# EasyEDA Pro project 2dof-experiment-system.eprj, board PCB2
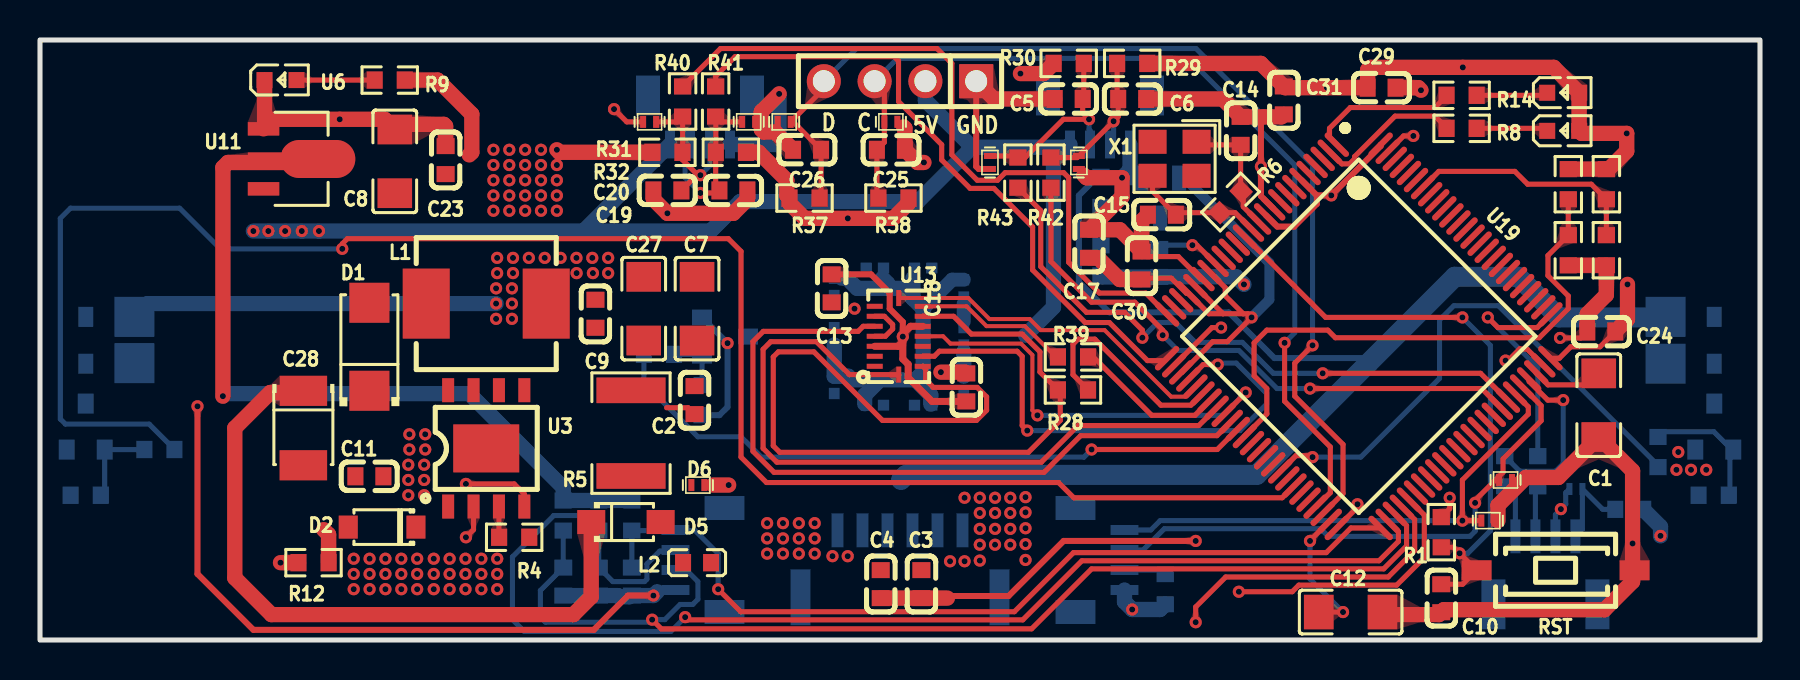
[diagram p5: board, top side]
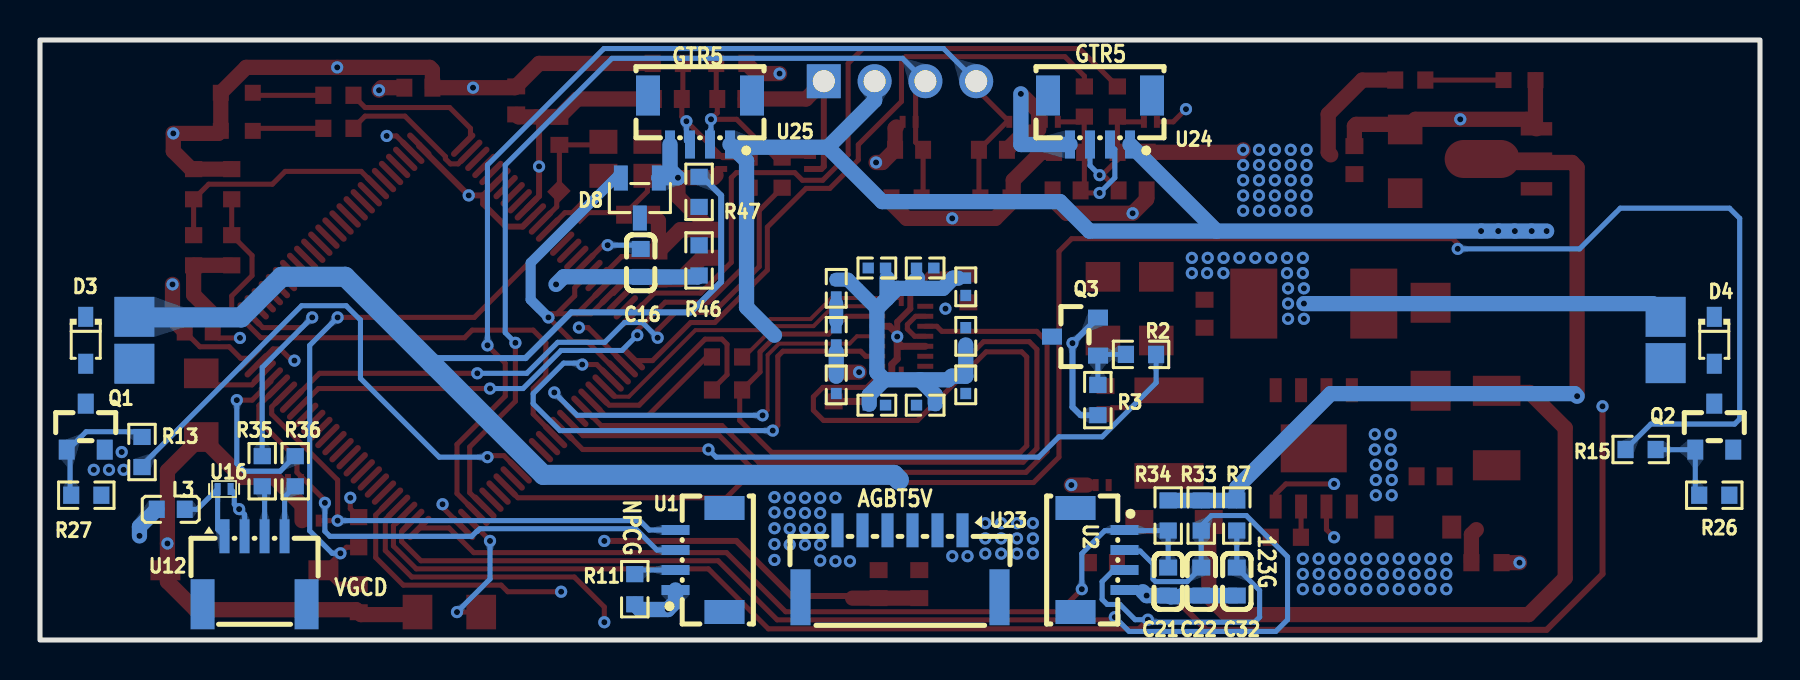
[diagram p6: board, bottom side, seen from below]

Outline 86 x 30 mm; copper layers: Top Layer, Inner1, Inner2, Bottom Layer. Coordinates in mm from the lower left corner of the outline.
Outline path: rectangle 0,30 86,0
Stack: Top Layer 0.035mm / Dielectric1 0.48mm PP er 4.5 / Inner1 0.035mm / Dielectric2 0.48mm FR4 er 4.5 / Inner2 0.035mm / Dielectric3 0.48mm PP er 4.5 / Bottom Layer 0.035mm

## Design rules (mm)
spacing safeClearance (default): track to track 0.152, other pairs 0.152 to 0.3
track width trackWidth (default): min 0.127, default 0.254, max 2.54
track width power: min 0.254, default 0.762, max 2.54
differential pair differentialPair (default): width min 0.127, default 0.254, max 2.54; gap min 0.152, default 0.152
via viaSize (default): diameter min 0.5, default 0.61, max 10; hole min 0.3, default 0.305, max 6
net GND uses power
net VBAT uses power
net +5V uses power
net +5VUSB uses power
net VCC uses power
net AGND uses power

## Placement (name value [footprint] x y rotation side)
C1  22uF  [C1206]  77.94 11.74 90 top
C2  10uF  [C0603]  32.73 11.99 90 top
C3  0.1uF  [C0603]  44.07 2.79 270 top
C4  1uF  [C0603]  42.04 2.79 270 top
C5  47pF  [C0603]  51.44 27.05 0 top
C6  47pF  [C0603]  54.61 27.05 180 top
C7  22uF  [C1206]  32.85 16.57 90 top
C8  22uF  [C1206]  17.74 23.93 90 top
C9  0.1uF  [C0603]  27.77 16.31 90 top
C10  1uF  [C0603]  70.06 2.09 270 top
C11  0.1uF  [C0603]  16.47 8.18 0 top
C12  22uF  [C1206]  65.53 1.4 180 top
C13  0.1uF  [C0603]  39.58 17.58 90 top
C14  20pF  [C0603]  60.03 25.46 270 top
C15  20pF  [C0603]  56.09 21.27 0 top
C16  0.1uF  [C0603]  55.97 18.85 270 bottom
C17  0.1uF  [C0603]  52.45 19.81 90 top
C18  0.1uF  [C0603]  46.31 12.63 270 top
C19  47pF  [C0603]  34.67 22.48 180 top
C20  47pF  [C0603]  31.37 22.48 0 top
C21  0.1uF  [C0603]  27.94 2.92 270 bottom
C22  0.1uF  [C0603]  29.59 2.92 270 bottom
C23  0.1uF  [C0603]  20.28 23.99 270 top
C24  0.1uF  [C0603]  78.06 15.42 180 top
C25  47pF  [C0603]  42.54 24.51 180 top
C26  47pF  [C0603]  38.35 24.51 0 top
C27  22uF  [C1206]  30.19 16.57 90 top
C28  47uF  [CASE-B_3528]  13.17 10.6 270 top
C29  0.1uF  [C0603]  67.08 27.62 0 top
C30  0.1uF  [C0603]  55.08 18.73 90 top
C31  0.1uF  [C0603]  62.19 26.98 270 top
C32  0.1uF  [C0603]  26.16 2.92 270 bottom
D1  SS32  [SMA_L4.3-W2.6-LS5.2-RD]  16.47 14.66 90 top
D2  SMFJ6.0A  [SOD-123_L2.8-W1.8-LS3.7-RD]  17.11 5.64 180 top
D3  1N5819WS  [SOD-323_L1.8-W1.3-LS2.5-RD]  83.71 14.99 270 bottom
D4  1N5819WS  [SOD-323_L1.8-W1.3-LS2.5-RD]  2.29 14.99 270 bottom
D5  DSS34  [SOD-123FL_L2.7-W1.8-LS3.8-RD]  29.3 5.9 0 top
D6  PESD12VV1BL,315  [SOD-882_L1.0-W0.6-BI]  32.89 7.75 180 top
D8  BAV99  [SOT-23-3_L2.9-W1.3-P1.90-LS2.4-BR]  56.01 22.1 90 bottom
H1  PZ254V-11-04P  [HDR-TH_4P-P2.54-V-M]  43 27.94 180 top
L1  10uH  [IND-SMD_L7.3-W6.8]  22.31 16.82 0 top
L2  BLM18PG221SN1D  [L0603]  32.85 3.87 180 top
L3  BLM18PG221SN1D  [L0603]  79.46 6.53 180 bottom
NC  NC  [R0603]  78.32 22.79 90 top
NC#2  NC  [R0603]  76.41 22.79 90 top
NOREF  -  [Pad_e1115]  81.28 16.16 90 top
NOREF#2  -  [Pad_e1121]  4.72 13.84 90 top
NOREF#3  -  [Pad_e1119]  81.28 13.81 90 top
NOREF#4  -  [Pad_e1123]  4.72 16.16 90 top
Q1  AO3400  [SOT-23_L2.9-W1.3-P1.90-LS2.4-BR]  83.71 10.67 270 bottom
Q2  AO3400  [SOT-23_L2.9-W1.3-P1.90-LS2.4-BR]  2.29 10.67 270 bottom
Q3  AO3400  [SOT-23_L2.9-W1.3-P1.90-LS2.4-BR]  34.25 15.17 180 bottom
R1  10kΩ  [R0603]  70.06 5.39 90 top
R2  120Ω  [R0603]  30.95 14.28 180 bottom
R3  10kΩ  [R0603]  33.11 11.99 270 bottom
R4  1.1kΩ  [R0603]  23.71 5.14 180 top
R5  0.3Ω  [R1812]  29.55 10.34 90 top
R6  1MΩ  [R0603]  59.52 21.9 45 top
R7  10kΩ  [R0603]  26.16 6.22 90 bottom
R8  1.5kΩ  [R0603]  71.08 25.58 180 top
R9  1.5kΩ  [R0603]  17.49 28 180 top
R11  5.1kΩ  [R0603]  56.26 2.54 270 bottom
R12  0Ω  [R0603]  13.68 3.87 0 top
R13  120Ω  [R0603]  80.9 9.4 270 bottom
R14  1.5kΩ  [R0603]  71.08 27.23 180 top
R15  120Ω  [R0603]  5.97 9.53 0 bottom
R16  430Ω  [R0402]  39.71 15.18 270 bottom
R17  430Ω  [R0402]  46.19 15.18 270 bottom
R18  430Ω  [R0402]  39.71 17.66 90 bottom
R19  430Ω  [R0402]  41.74 18.6 0 bottom
R20  430Ω  [R0402]  41.74 11.74 180 bottom
R21  430Ω  [R0402]  44.16 18.6 180 bottom
R22  430Ω  [R0402]  46.19 17.58 90 bottom
R23  430Ω  [R0402]  39.71 12.76 90 bottom
R24  430Ω  [R0402]  46.19 12.76 90 bottom
R25  430Ω  [R0402]  44.16 11.74 0 bottom
R26  10kΩ  [R0603]  2.29 7.24 180 bottom
R27  10kΩ  [R0603]  83.68 7.24 180 bottom
R28  33Ω  [R0603]  51.65 12.5 0 top
R29  1.5kΩ  [R0603]  54.61 28.83 0 top
R30  1.5kΩ  [R0603]  51.44 28.83 180 top
R31  1.5kΩ  [R0603]  31.37 24.38 180 top
R32  1.5kΩ  [R0603]  34.54 24.38 0 top
R33  10kΩ  [R0603]  27.94 6.22 90 bottom
R34  10kΩ  [R0603]  29.59 6.22 90 bottom
R35  100Ω  [R0603]  74.89 8.44 90 bottom
R36  100Ω  [R0603]  73.24 8.44 90 bottom
R37  4.7kΩ  [R0603]  38.23 22.1 180 top
R38  4.7kΩ  [R0603]  42.67 22.1 0 top
R39  33Ω  [R0603]  51.65 14.15 0 top
R40  33Ω  [R0603]  32.13 26.92 270 top
R41  33Ω  [R0603]  33.78 26.92 270 top
R42  33Ω  [R0603]  50.55 23.37 90 top
R43  33Ω  [R0603]  48.9 23.37 90 top
R44  100KΩ  [R0603]  78.32 19.49 270 top
R45  100KΩ  [R0603]  76.41 19.49 270 top
R46  10KΩ  [R0603]  53.05 18.98 90 bottom
R47  5.1KΩ  [R0603]  53.05 22.41 90 bottom
RST  K2-1107ST-E1SW-06  [SW-SMD_L6.0-W3.6-LS8.0]  75.78 3.49 0 top
U1  ZX-SH1.0-4PLT  [CONN-SMD_4P-P1.00_ZX-SH1.0-4PLN]  53 4 90 bottom
U2  ZX-SH1.0-4PLT  [CONN-SMD_4P-P1.00_ZX-SH1.0-4PLN]  33 4 270 bottom
U3  TP5400  [ESOP-8_L4.9-W3.9-P1.27-LS6.0-BL-EP]  22.31 9.58 0 top
U5  YLED0603B  [LED0603-RD]  76.16 25.46 0 top
U6  YLED0603B  [LED0603-RD]  12.03 28 0 top
U8  YLED0603B  [LED0603-RD]  76.16 27.36 0 top
U9  PESD5V0F1BL  [SOD-882_L1.0-W0.6-BI]  47.5 23.88 270 top
U10  PESD5V0F1BL  [SOD-882_L1.0-W0.6-BI]  51.94 23.88 270 top
U11  AMS1117-3.3  [SOT-89_L4.5-W2.5-P1.50-LS4.2-BR]  12.53 24.06 180 top
U12  ZX-SH1.0-4PWT  [CONN-SMD_4P-P1.00_MEGASTAR_ZX-SH1.0-4PWT]  75.27 3.49 180 bottom
U13  BMI088  [LGA-16_L4.5-W3.0-P0.50-BL]  42.94 15.18 0 top
U14  PESD5V0F1BL  [SOD-882_L1.0-W0.6-BI]  35.43 25.91 0 top
U15  PESD5V0F1BL  [SOD-882_L1.0-W0.6-BI]  30.48 25.91 180 top
U16  PESD5V0F1BL  [SOD-882_L1.0-W0.6-BI]  76.79 7.55 180 bottom
U17  PESD5V0F1BL  [SOD-882_L1.0-W0.6-BI]  42.54 25.91 0 top
U18  PESD5V0F1BL  [SOD-882_L1.0-W0.6-BI]  37.21 25.91 180 top
U19  STM32F407VET6  [LQFP-100_L14.0-W14.0-P0.50-LS16.0-BL]  65.94 15.18 225 top
U20  PESD5V0F1BL  [SOD-882_L1.0-W0.6-BI]  73.28 8 180 top
U21  PESD5V0F1BL  [SOD-882_L1.0-W0.6-BI]  72.39 5.97 180 top
U23  BX-BX-GH1.25-6PLT  [CONN-SMD_6P-P1.25_BX-BX-GH1.25-6PLT]  43 3.81 0 bottom
U24  ZX-SH1.0-4PLT  [CONN-SMD_4P-P1.00_ZX-SH1.0-4PLN]  33 26 0 bottom
U25  ZX-SH1.0-4PLT  [CONN-SMD_4P-P1.00_ZX-SH1.0-4PLN]  53 26 0 bottom
X1  8MHz  [CRYSTAL-SMD_4P-L3.2-W2.5-BL]  56.73 24.06 180 top

## Footprints (pads in the part's own frame, mm; a bottom-side part is the same pattern mirrored in y, then rotated)
C0603
  rect 0.8x0.9 smd: 1(-0.7,0) 2(0.7,0)
C1206
  rect 1.485x1.728 smd: 1(-1.593,0) 2(1.593,0)
CASE-B_3528
  rect 1.506x2.376 smd: 1(-1.861,0) 2(1.861,0)
CONN-SMD_4P-P1.00_MEGASTAR_ZX-SH1.0-4PWT
  rect 0.5x1.7 smd: 1(-1.5,1.7) 2(-0.5,1.7) 3(0.5,1.7) 4(1.5,1.7)
  rect 1.2x2.5 smd: 5(2.6,-1.7) 6(-2.6,-1.7)
CONN-SMD_4P-P1.00_ZX-SH1.0-4PLN
  rect 0.5x1.4 smd: 1(-1.5,1.225) 2(-0.5,1.225) 3(0.5,1.225) 4(1.5,1.225)
  rect 1.2x2 smd: 5(2.6,-1.225) 6(-2.6,-1.225)
CONN-SMD_6P-P1.25_BX-BX-GH1.25-6PLT
  rect 0.6x1.7 smd: 1(-3.125,-1.675) 2(-1.875,-1.675) 3(-0.625,-1.675) 4(0.625,-1.675) 5(1.875,-1.675) 6(3.125,-1.675)
  rect 1x2.8 smd: 7(4.975,1.675) 8(-4.975,1.675)
CRYSTAL-SMD_4P-L3.2-W2.5-BL
  rect 1.4x1.2 smd: 1(-1.1,-0.85) 2(1.1,-0.85) 3(1.1,0.85) 4(-1.1,0.85)
ESOP-8_L4.9-W3.9-P1.27-LS6.0-BL-EP
  rect 0.6x1.2 smd: 1(-1.905,-2.909) 2(-0.635,-2.909) 3(0.635,-2.909) 4(1.905,-2.909) 5(1.905,2.909) 6(0.635,2.909) 7(-0.635,2.909) 8(-1.905,2.909)
  rect 3.3x2.4 smd: 9(0,0)
HDR-TH_4P-P2.54-V-M
  rect 1.7x1.7 hole 1.1: 1(-3.81,0)
  round 1.7 hole 1.1: 2(-1.27,0) 3(1.27,0) 4(3.81,0)
IND-SMD_L7.3-W6.8
  rect 2.35x3.5 smd: 1(-3,0) 2(3,0)
L0603
  rect 0.8x0.864 smd: 1(-0.7,0) 2(0.7,0)
LED0603-RD
  rect 0.8x0.8 smd: 1(-0.799,0) 2(0.799,0)
LGA-16_L4.5-W3.0-P0.50-BL
  rect 0.8x0.25 smd: 1(-1.2,-1.498) 2(-1.2,-0.998) 3(-1.2,-0.498) 4(-1.2,0.002) 5(-1.2,0.502) 6(-1.2,1.002) 7(-1.2,1.502) 9(1.2,1.502) 10(1.2,1.002) 11(1.2,0.502) 12(1.2,0.002) 13(1.2,-0.498) 14(1.2,-0.998) 15(1.2,-1.498)
  rect 0.25x0.8 smd: 8(0,1.915) 16(0,-1.915)
LQFP-100_L14.0-W14.0-P0.50-LS16.0-BL
  oval 0.3x1.6 smd: 1(-6,-7.55) 2(-5.5,-7.55) 3(-5,-7.55) 4(-4.5,-7.55) 5(-4,-7.55) 6(-3.5,-7.55) 7(-3,-7.55) 8(-2.5,-7.55) 9(-2,-7.55) 10(-1.5,-7.55) 11(-1,-7.55) 12(-0.5,-7.55) 13(0,-7.55) 14(0.5,-7.55) 15(1,-7.55) 16(1.5,-7.55) 17(2,-7.55) 18(2.5,-7.55) 19(3,-7.55) 20(3.5,-7.55) 21(4,-7.55) 22(4.5,-7.55) 23(5,-7.55) 24(5.5,-7.55) 25(6,-7.55) 51(6,7.55) 52(5.5,7.55) 53(5,7.55) 54(4.5,7.55) 55(4,7.55) 56(3.5,7.55) 57(3,7.55) 58(2.5,7.55) 59(2,7.55) 60(1.5,7.55) 61(1,7.55) 62(0.5,7.55) 63(0,7.55) 64(-0.5,7.55) 65(-1,7.55) 66(-1.5,7.55) 67(-2,7.55) 68(-2.5,7.55) 69(-3,7.55) 70(-3.5,7.55) 71(-4,7.55) 72(-4.5,7.55) 73(-5,7.55) 74(-5.5,7.55) 75(-6,7.55)
  oval 1.6x0.3 smd: 26(7.55,-6) 27(7.55,-5.5) 28(7.55,-5) 29(7.55,-4.5) 30(7.55,-4) 31(7.55,-3.5) 32(7.55,-3) 33(7.55,-2.5) 34(7.55,-2) 35(7.55,-1.5) 36(7.55,-1) 37(7.55,-0.5) 38(7.55,0) 39(7.55,0.5) 40(7.55,1) 41(7.55,1.5) 42(7.55,2) 43(7.55,2.5) 44(7.55,3) 45(7.55,3.5) 46(7.55,4) 47(7.55,4.5) 48(7.55,5) 49(7.55,5.5) 50(7.55,6) 76(-7.55,6) 77(-7.55,5.5) 78(-7.55,5) 79(-7.55,4.5) 80(-7.55,4) 81(-7.55,3.5) 82(-7.55,3) 83(-7.55,2.5) 84(-7.55,2) 85(-7.55,1.5) 86(-7.55,1) 87(-7.55,0.5) 88(-7.55,0) 89(-7.55,-0.5) 90(-7.55,-1) 91(-7.55,-1.5) 92(-7.55,-2) 93(-7.55,-2.5) 94(-7.55,-3) 95(-7.55,-3.5) 96(-7.55,-4) 97(-7.55,-4.5) 98(-7.55,-5) 99(-7.55,-5.5) 100(-7.55,-6)
Pad_e1115
  rect 2x2 smd far side: 1(0,0)
Pad_e1119
  rect 2x2 smd far side: 1(0,0)
Pad_e1121
  rect 2x2 smd far side: 1(0,0)
Pad_e1123
  rect 2x2 smd far side: 1(0,0)
R0402
  rect 0.566x0.54 smd: 1(-0.433,0) 2(0.433,0)
R0603
  rect 0.806x0.864 smd: 1(-0.753,0) 2(0.753,0)
R1812
  rect 1.282x3.456 smd: 1(-2.141,0) 2(2.141,0)
SMA_L4.3-W2.6-LS5.2-RD
  rect 2x2 smd: 1(-2.2,0) 2(2.2,0)
SOD-123_L2.8-W1.8-LS3.7-RD
  rect 0.95x1.15 smd: 1(-1.692,0) 2(1.692,0)
SOD-123FL_L2.7-W1.8-LS3.8-RD
  rect 1.4x1.2 smd: 1(-1.735,0) 2(1.735,0)
SOD-323_L1.8-W1.3-LS2.5-RD
  rect 1x0.75 smd: 1(-1.173,0) 2(1.173,0)
SOD-882_L1.0-W0.6-BI
  rect 0.3x0.6 smd: 1(-0.325,0) 2(0.325,0)
SOT-23-3_L2.9-W1.3-P1.90-LS2.4-BR
  rect 1.25x0.7 smd: 1(1,-0.95) 2(1,0.95) 3(-1,0)
SOT-23_L2.9-W1.3-P1.90-LS2.4-BR
  rect 1x0.8 smd: 1(1.15,-0.95) 2(1.15,0.95) 3(-1.15,0)
SOT-89_L4.5-W2.5-P1.50-LS4.2-BR
  rect 1.575x0.672 smd: 1(1.356,-1.5) 3(1.356,1.5)
  custom 5.377x1.9 smd: 2(-1.356,0.009)
SW-SMD_L6.0-W3.6-LS8.0
  rect 1.5x1 smd: 1(-3.95,0) 2(3.95,0)

## Nets
As in the schematic, except:
GND: C1.1 C3.2 C4.2 C5.1 C6.1 C8.2 C10.2 C12.1 C13.1 C14.1 C15.1 C16.2 C17.2 C18.1 C19.1 C20.1 C21.2 C22.2 C23.1 C24.2 C25.1 C26.1 C29.2 C30.2 C31.2 C32.2 D6.1 D8.1 H1.1 R11.2 R12.1 R44.2 R45.2 R46.1 RST.2 U1.1 U2.4 U6.1 U9.2 U10.2 U11.1 U12.2 U13.4 U13.6 U13.7 U14.2 U15.2 U16.2 U17.2 U18.2 U19.10 U19.20 U19.27 U19.74 U19.99 U20.1 U21.1 U24.4 U25.4
VBAT: C7.2 C9.2 C27.2 D3.1 D4.1 L1.2 NOREF.1 NOREF#4.1 R47.2 U3.6 U23.3 U23.4
$1N68715: D4.2 NOREF#2.1 Q2.3
$1N70428: D3.2 NOREF#3.1 Q1.3
$1N138361: C10.1 R1.1 RST.1 U19.14
$1N140381: NC.1 R44.1 U19.94
$1N140807: NC#2.1 R45.1 U19.37

Pads without a net: U1 5 6; U2 5 6; U12 5 6; U13 1 2 13; U19 3 4 5 7 8 9 15 16 17 23 24 38 39 40 41 43 45 46 56 57 58 59 60 61 62 63 64 65 66 67 77 78 79 80 81 82 83 84 85 86 87 88 89 90 91 92 93 95 96 97 98; U23 7 8; U24 5 6; U25 5 6; X1 2 4

## Via types
v1: diameter 0.61, hole 0.305, Top Layer to Bottom Layer, 198 vias

## Routing (per net, layer and track width the routed paths; a pad name or vN(x,y) marks a point on that pad's centre or on a via; arc(x,y) is an arc through that point)
+5V: length 120.3
  Top Layer w0.762: D5.1 27.56,2.16 26.67,1.27 11.57,1.27 9.74,3.1 9.74,10.6 11.52,12.38 13.09,12.38 C28.1
  Bottom Layer w0.7: 44.16,16.57 45.6,18.02 R22.2
  Bottom Layer w0.762: 40.09,18.09 40.35,18.09 40.85,17.58 42.38,17.58 ; 43.65,17.07 43.65,18.09 ; 43.65,17.07 43.14,17.58 42.38,17.58 ; 43.65,17.07 44.16,16.57 44.16,13.39 43.78,13.01 ; U24.1 27.17,20.45 ; 27.17,20.45 33.53,20.45 35,21.92 43.89,21.92 46.61,24.64 ; 27.17,20.45 v1(13.95,20.45) v1(13.09,20.45) v1(12.26,20.45) v1(11.42,20.45) v1(10.67,20.45) ; 46.61,24.64 44.27,26.98 H1.2 ; 46.61,24.64 51.36,24.64 ; 46.19,13.19 46.19,14.41 ; 44.54,11.79 44.54,12.25 43.78,13.01 ; 49.28,15.24 50.67,16.64 50.67,23.95 51.36,24.64 ; 42.38,17.58 42.38,17.84 42.12,18.09 ; 51.36,24.64 U25.1 ; 42,13.01 41.24,12.25 41.24,11.82 ; 42,13.01 43.78,13.01 ; 42,13.01 40.59,13.01 40.41,13.19 39.71,13.19 R16.2
  vias: v1(18.41,8.76) v1(18.41,8) v1(18.41,7.24) v1(18.47,10.29) v1(18.47,9.53) v1(19.21,8.76) v1(19.21,8) v1(19.21,7.24) v1(19.26,10.29) v1(19.26,9.53)
+5VUSBIN:
  vias: v1(36.36,5.84) v1(36.36,5.08) v1(36.36,4.32) v1(37.15,5.84) v1(37.15,5.08) v1(37.15,4.32) v1(37.94,5.84) v1(37.94,5.08) v1(37.94,4.32) v1(38.74,5.84) v1(38.74,5.08) v1(38.74,4.32) v1(39.62,4.19) v1(40.39,4.19)
AGND: length 8.2
  Top Layer w0.762: 14.18,5.52 14.43,5.27 14.43,3.87
  Bottom Layer w0.3: R3.2 33.97,11.24 34.38,11.65 v1(34.38,14.84) Q3.2
  vias: v1(15.69,4.06) v1(15.69,3.3) v1(15.69,2.54) v1(16.48,4.06) v1(16.48,3.3) v1(16.48,2.54) v1(17.27,4.06) v1(17.27,3.3) v1(17.27,2.54) v1(18.06,4.06) v1(18.06,3.3) v1(18.06,2.54) v1(18.86,4.06) v1(18.86,3.3) v1(18.86,2.54) v1(19.69,4.06) v1(19.69,3.3) v1(19.69,2.54) v1(20.48,4.06) v1(20.48,3.3) v1(20.48,2.54) v1(21.27,4.06) v1(21.27,3.3) v1(21.27,2.54) v1(22.07,4.06) v1(22.07,3.3) v1(22.07,2.54) v1(22.86,4.06) v1(22.86,3.3) v1(22.86,2.54) v1(45.5,3.94) v1(46.23,7.11) v1(46.23,3.94) v1(46.99,7.11) v1(46.99,6.35) v1(46.99,5.56) v1(46.99,4.76) v1(46.99,3.97) v1(47.75,7.11) v1(47.75,6.35) v1(47.75,5.56) v1(47.75,4.76) v1(48.51,7.11) v1(48.51,6.35) v1(48.51,5.56) v1(48.51,4.76) v1(49.28,7.14) v1(49.28,6.38) v1(49.28,5.59) v1(49.28,4.8) v1(49.28,4) v1(81.82,8.51) v1(81.91,9.4) v1(82.55,8.51) v1(83.31,8.51)
GND: length 187.4
  Top Layer w0.254: v1(73.28,13.97) 73.41,13.97 73.99,14.55 74.35,14.55 U19.74 ; U19.20 58.04,18.05 56.92,19.17 55.33,19.17 C30.2 ; v1(28.7,26.54) 29.34,25.91 U15.2 ; 41.74,15.19 42.27,15.19 42.63,15.55 42.63,15.77 42.22,16.19 41.74,16.19 ; v1(76,15.1) 77.04,15.1 C24.2 ; v1(68.67,25.2) 68.18,25.2 U19.99 ; 56.71,13.73 58.6,15.62 v1(59.06,15.62)
  Top Layer w0.3: v1(30.67,2.22) 29.4,2.22 27.69,0.51 10.67,0.51 7.87,3.3 v1(7.87,11.68) ; H1.1 46.81,23.67 46.93,23.55 U9.2 ; v1(57.78,4.95) 51.18,4.95 48.43,2.2 45.61,2.2 ; 61.66,21.58 61.05,22.19 v1(61.05,23.68) 61.05,26.02 61.18,26.16
  Top Layer w0.762: 43.18,25.65 43.25,25.59 C25.1 43.88,23.88 v1(44.2,23.88) ; C20.1 30.67,22.04 v1(31.37,21.34) 34.67,21.34 35.37,22.04 35.37,22.48 ; v1(34.43,7.75) 33.66,7.75 ; C24.2 77.37,16.31 78.32,17.26 R44.2 R45.2 ; v1(36.96,27.31) 36.07,26.42 36.07,25.53 36.19,25.4 36.76,25.4 C26.1 ; C12.1 67.25,1.27 69.95,1.27 70.19,1.52 78.22,1.52 79.63,2.92 v1(79.63,4.83) 79.63,8.46 C1.1 75.92,8.13 74.29,8.13 72.9,6.73 72.9,5.97 ; v1(12.03,3.87) R12.1 ; C31.2 62.07,26.16 C14.1 59.14,27.05 C6.1 ; C15.1 55.08,20.95 C30.2 53.99,20.51 C17.2 54.1,22.16 v1(54.1,23.11) 52.32,23.11 52.2,23.24 ; 11.23,25.61 U6.1 ; 11.23,25.61 11.65,26.03 v1(14.99,26.03) 17.23,26.03 C8.2 18,25.78 20.19,25.78 20.28,25.69 C23.1 ; 11.23,25.61 U11.1 ; C4.2 C3.2 45.37,2.09 ; C5.1 47.7,27.05 H1.1 ; C29.2 68.92,27.62 v1(69.05,27.49) ; C18.1 46.25,13.39 v1(45.04,13.39)
  Bottom Layer w0.254: 75.77,5.19 75.77,6.27 v1(76.04,6.54) 76.29,6.79 76.29,7.37 U16.2
  Bottom Layer w0.762: U24.4 36.96,24.78 v1(36.96,27.31) ; R46.1 53.12,18.15 C16.2 55.98,18.16 59.82,18.16 v1(60.2,17.78) ; C32.2 C21.2 28.89,2.22 28.95,2.16 29.47,2.16 29.53,2.22 C22.2 v1(30.67,2.22) 30.86,2.41 ; U1.1 54.22,1.91 v1(54.61,1.52) 56,1.52 R11.2 ; 55.06,23.1 55.04,23.11 v1(54.1,23.11) 54.5,23.51 U25.4
  vias: v1(40.73,16.57)
VBAT: length 83.6
  Bottom Layer w0.3: 66.42,13.84 66.17,14.1 61.72,14.1 59.44,16.38 53.47,16.38 51.94,17.91 51.94,22.22 52.88,23.16 R47.2
  Bottom Layer w0.762: NOREF#4.1 5.38,16.82 v1(22.8,16.82)
  Bottom Layer w1: NOREF.1 81.25,16.13 75.95,16.13 73.91,18.16 70.74,18.16 60.83,8.25 43.31,8.25 43.05,8
  vias: v1(22.8,17.58) v1(22.8,16.06) v1(22.86,19.11) v1(22.86,18.34) v1(23.6,17.58) v1(23.6,16.82) v1(23.6,16.06) v1(23.65,19.11) v1(23.65,18.34) v1(24.44,19.11) v1(25.24,19.11) v1(26.03,19.11) v1(26.82,19.11) v1(26.83,18.34) v1(27.62,19.11) v1(27.65,18.34) v1(28.41,19.11) v1(28.41,18.34)
VCC: length 157.2
  Top Layer w0.254: 60.16,16.31 59.26,17.21 59.26,17.61 58.48,18.4 ; 60.16,16.31 59.15,16.31 ; 60.16,16.31 60.4,16.31 v1(60.58,16.13) 59.37,14.92 58.63,14.92 57.1,13.38 U19.28 ; 59.15,16.31 58.44,16.31 U19.22 57.32,17.34 56.57,18.09 55.14,18.09 C30.1 ; 59.15,16.31 U19.21 ; v1(70.49,7.11) 70.49,6.56 R1.2 ; U19.50 65.87,6.63 v1(65.87,6.79) ; U19.75 75.97,14.09 76.54,14.66 78,14.66 C24.1
  Top Layer w0.3: 63.84,22.23 63.84,21.81 62.71,20.67 61.86,20.67 61.31,21.23 ; 63.84,22.23 v1(64.56,22.23) 67.03,24.7 67.03,24.76 ; 63.84,22.23 63.07,23 ; C13.2 41.55,18.28 42.48,17.35 42.48,16.56 43.14,15.91 43.14,15.3
  Top Layer w0.35: C18.2 44.6,11.93 43.41,13.12 43.41,13.78 43.14,14.05 43.14,14.92 ; 41.74,14.69 42.91,14.69 43.14,14.92 ; 43.14,14.92 v1(43.14,15.17) 43.08,15.23 43.53,15.69 U13.11
  Top Layer w0.762: R30.2 50.17,28.32 v1(49.02,28.32) ; 66.32,27.62 v1(64.35,27.62) 62.25,27.62 61.04,28.83 R29.2 ; C29.1 66.38,28.5 66.51,28.63 v1(71.14,28.63) 75.69,28.63 U8.2 U5.2 77.09,25.33 v1(79.34,25.33) 79.34,24.44 78.44,23.54 NC.2 NC#2.2 ; C24.1 79.38,16.03 v1(79.38,17.78) ; C17.1 52.9,19.11 53.98,18.03 C30.1 ; R9.1 19.88,28 21.59,26.29 21.59,24.38 21.46,24.26 ; U11.2 13.71,23.88 9.4,23.88 9.14,23.62 v1(9.14,12.19) ; v1(25.84,24.51) 25.97,24.38 R31.2 ; R38.2 43.43,21.84 42.67,21.08 v1(40.39,21.08) 38.23,21.08 37.47,21.84 R37.2 37.34,22.23 37.34,22.99 35.94,24.38 R32.2
  Bottom Layer w0.5: v1(60.58,16.13) 61.47,17.02 61.47,18.86 56.92,23.41
  Bottom Layer w0.762: L3.1 81.03,5.67 v1(81.03,5.21) ; R34.2 R33.2 R7.2 26.16,7.62 21.46,12.32 9.27,12.32 v1(9.14,12.19)
  vias: v1(22.67,24.51) v1(22.67,23.75) v1(22.67,22.99) v1(22.67,22.22) v1(22.67,21.46) v1(23.46,24.51) v1(23.46,23.75) v1(23.46,22.99) v1(23.46,22.22) v1(23.46,21.46) v1(24.26,24.51) v1(24.26,23.75) v1(24.26,22.99) v1(24.26,22.22) v1(24.26,21.46) v1(25.05,24.51) v1(25.05,23.75) v1(25.05,22.99) v1(25.05,22.22) v1(25.05,21.46) v1(25.84,23.75) v1(25.84,22.99) v1(25.84,22.22) v1(25.84,21.46)
CS1_ACCEL: length 26.9
  Top Layer w0.254: v1(58.89,13.77) 58.16,13.77 57.42,13.03 ; v1(49.36,10.47) 49.11,10.72 49.11,14.19 48.85,14.44 44.97,14.44 44.71,14.19 U13.14
  Bottom Layer w0.254: v1(49.36,10.47) 60,10.47 61.34,11.81 61.34,12.32 59.82,13.84 58.96,13.84 v1(58.89,13.77)
CS1_GYRO: length 37.3
  Top Layer w0.254: U19.35 58.85,10.22 52.03,10.22 50.2,8.38 36.7,8.38 35.65,9.44 35.65,14.92 36.16,15.43 40.91,15.43 41.16,15.69 41.74,15.69
DN: length 26
  Top Layer w0.254: U19.70 74.41,11.66 74.41,11.3 71.12,8 v1(71.12,5.97) U21.2
  Bottom Layer w0.254: U1.4 55.54,5.5 56.01,5.97 v1(71.12,5.97)
DP: length 27.2
  Top Layer w0.254: v1(71.75,6.86) 71.75,6.98 73.15,8.38 73.15,9.06 75.06,10.96 75.06,11.72 U19.71
  Bottom Layer w0.254: v1(71.75,6.86) 71.75,5.44 71.5,5.18 64.41,5.18 64.16,5.44 64.13,5.44 64.01,5.56 56.22,5.56 55.15,4.5 U1.3
IICS_SCL: length 48.5
  Top Layer w0.254: 63.78,6.66 63.81,6.66 64.52,7.37 64.52,9.65 62.23,11.94 v1(62.23,14.86) ; R38.1 41.84,22.17 C25.2 42.22,24.89 U17.1 42.22,27.45 H1.3
  Bottom Layer w0.254: v1(62.23,14.86) 62.74,15.37 62.74,23.75 57.4,29.08 42.87,29.08 H1.3
IICS_SDA: length 54
  Top Layer w0.254: U19.48 65.15,7.33 65.15,9.78 62.74,12.19 62.74,13.84 v1(63.63,14.73) ; R37.1 39.05,22.17 C26.2 37.66,25.91 U18.1 39.19,27.56 H1.4
  Bottom Layer w0.254: v1(63.63,14.73) 63.63,23.75 57.8,29.57 40.82,29.57 H1.4
INT_ACCEL: length 36.7
  Top Layer w0.254: U19.33 57.94,10.72 51.9,10.72 50.07,8.89 36.85,8.89 36.16,9.58 36.16,14.53 36.54,14.92 38.82,14.92 40.47,13.27 U13.16
INT_GYRO: length 21.5
  Top Layer w0.2: U13.12 45.16,15.19 45.52,14.82 49.05,14.82 49.62,14.25 49.62,11.48 v1(49.87,11.23)
  Top Layer w0.254: U19.34 60.28,12.36 v1(60.28,12.38)
  Bottom Layer w0.254: v1(49.87,11.23) 59.14,11.23 v1(60.28,12.38)
IOCHA: length 17
  Top Layer w0.254: 21.68,6.67 21.68,5.52 v1(21.3,5.14) ; v1(57.78,0.89) 57.78,1.65 59.28,3.15 67.41,3.15 68.73,4.47 68.73,6.02 68.09,6.66
IOSTB: length 16.9
  Top Layer w0.254: U3.4 24.22,7.3 23.71,7.8 v1(21.3,7.8) ; U19.55 69.22,6.25 69.22,4.12 67.83,2.74 62.94,2.74 62.61,2.41 v1(59.94,2.41)
LED1: length 7.5
  Top Layer w0.254: U19.1 64.48,25.13 64.48,25.58 65.52,26.62 69.75,26.62 70.33,27.21 R14.2
LED2: length 7.4
  Top Layer w0.254: U19.2 65.09,23.81 65.48,23.81 65.73,24.06 65.73,24.17 67.75,26.19 69.75,26.19 70.33,25.61 R8.2
PWM1: length 27.5
  Top Layer w0.254: U19.42 62.8,9.22 63.55,9.22 v1(63.63,9.14)
  Bottom Layer w0.254: v1(63.63,9.14) 66.04,9.14 69.98,13.08 69.98,16 70.69,16.71 72.92,16.71 80.9,8.73 R13.2
PWM2: length 91.1
  Top Layer w0.254: v1(15.11,19.56) 15.11,19.81 15.37,20.07 34.42,20.07 35.05,19.43 35.05,9.14 36.32,7.87 50.93,7.87 51.69,7.11 62.11,7.11 U19.44
  Bottom Layer w0.254: v1(15.11,19.56) 9.02,19.56 6.98,21.59 1.52,21.59 1.02,21.08 1.02,11.05 1.27,10.8 5.46,10.8 6.72,9.53 R15.2
PWM_HEATER: length 33.2
  Top Layer w0.254: U19.36 58.86,9.53 v1(52.58,9.53)
  Bottom Layer w0.254: v1(52.58,9.53) 52.2,9.14 36.07,9.14 35.05,10.16 32.89,10.16 30.19,12.86 R2.2
SPI1_CLK: length 17.1
  Top Layer w0.2: U19.30 57.26,12.17 56.56,12.17 53.23,15.49 50.04,15.49 49.49,16.05 47.47,16.05 46.42,17.1 U13.8
SPI1_MISO: length 10.8
  Top Layer w0.254: R28.2 52.4,12.51 51.65,13.26 51.65,14.79 51.9,15.04 52.74,15.04 56.05,11.74 57.54,11.74 U19.31
SPI1_MOSI: length 7.6
  Top Layer w0.254: 58.48,11.97 57.74,11.23 55.59,11.23 52.66,14.15 R39.2
SW1: length 43.8
  Top Layer w0.254: 67.03,5.6 65.55,5.6 64.31,4.37 51.67,4.37 48.72,1.41 35.03,1.41 v1(33.91,2.54)
  Bottom Layer w0.254: 31.74,5.47 32.76,5.47 33.91,4.32 v1(33.91,2.54) ; 31.74,5.47 R34.1 29.59,3.62 ; 31.74,5.47 U2.1
SW2: length 63.6
  Top Layer w0.254: v1(32.26,1.14) 32.39,1.01 49.14,1.01 52.09,3.96 66.95,3.96 67.92,4.93 67.92,5.42 U19.52
  Bottom Layer w0.254: U2.2 31.72,4.44 30.99,4.44 30.35,3.8 30.35,3.04 30.23,2.92 28.64,2.92 27.94,3.62 R33.1 27.94,5.72 27.43,6.22 25.69,6.22 23.62,4.16 23.62,1.02 24.21,0.43 31.54,0.43 v1(32.26,1.14)
SW3: length 57
  Top Layer w0.254: v1(30.61,1.02) 31.06,0.56 49.58,0.56 52.58,3.56 67.18,3.56 68.33,4.7 68.33,5.72 U19.53
  Bottom Layer w0.254: U2.3 32.31,3.5 32.89,2.92 32.89,2.03 32.64,1.78 32,1.78 31.24,1.02 v1(30.61,1.02) 30.48,0.89 25.27,0.89 25.02,1.14 25.02,2.48 26.16,3.62 R7.1
SWCLK: length 11.6
  Top Layer w0.254: U19.76 74.86,15.62 72.9,15.62 v1(72.39,16.13)
  Bottom Layer w0.254: R35.2 74.89,13.63 v1(72.39,16.13)
SWDIO: length 8.8
  Top Layer w0.254: 74.46,13.03 74.46,12.93 75.39,11.99 v1(76.16,11.99)
  Bottom Layer w0.254: R36.2 73.99,8.44 75.78,8.44 76.16,8.82 v1(76.16,11.99)
USART1_RX: length 31.4
  Top Layer w0.254: v1(55.12,15.11) 55.12,15.49 54.23,16.38 52.32,16.38 50.04,18.67 50.04,21.47 R43.1 ; v1(64.13,13.33) 72.03,13.33 U19.69
  Bottom Layer w0.254: v1(64.13,13.33) 61.66,13.33 60.11,14.88 57.76,14.88 56.77,15.88 55.88,15.88 v1(55.12,15.11)
USART1_TX: length 29.4
  Top Layer w0.254: v1(56.13,15.24) 56.13,15.49 54.74,16.89 52.58,16.89 50.55,18.92 R42.1 ; v1(63.5,12.57) 72.08,12.57 U19.68
  Bottom Layer w0.254: v1(63.5,12.57) 61.85,12.57 59.94,14.48 56.9,14.48 v1(56.13,15.24)
USART2_RX: length 32.7
  Top Layer w0.254: U19.26 56.24,13.97 55.37,13.97 53.47,15.87 52.26,15.87 49.63,18.5 49.63,20.65 47.7,22.58 46.51,22.58 45.09,24 45.09,24.77 42.93,26.92 42.93,28.96 42.72,29.17 34.75,29.17 33.78,28.19 R41.1
USART2_TX: length 36
  Top Layer w0.254: U19.25 55.29,17.35 52.97,17.35 51.44,18.88 51.44,23.11 51.18,23.37 48.26,23.37 47.88,22.99 46.86,22.99 45.59,24.26 45.59,28.83 44.85,29.57 34.03,29.57 R40.1
$1N20372: length 1.5
  Top Layer w0.254: R4.2 22.95,5.14 U3.3
$1N20428: length 4.6
  Bottom Layer w0.254: L3.2 78.14,6.53 U16.1 77.12,5.53 76.77,5.19
$1N20430: length 2.5
  Bottom Layer w0.254: R35.1 74.77,7.57 74.77,5.19
$1N20431: length 2.7
  Bottom Layer w0.254: 73.77,5.19 73.77,7.15 R36.1
$1N20434: length 3.9
  Top Layer w0.254: R9.2 U6.2
$1N20465: length 4.3
  Bottom Layer w0.254: R15.1 5.21,9.52 Q2.1 3.24,7.44 R26.1
$1N20470: length 1.5
  Top Layer w0.254: 31.33,11.61 32.41,11.61 C2.1
$1N28925: length 7.8
  Top Layer w0.2: R39.1 50.79,14.15 49.25,15.69 47.32,15.69 46.33,16.69 U13.9
$1N32308: length 0.9
  Bottom Layer w0.7: 46.19,16.82 46.19,15.93
$1N33131: length 2.9
  Bottom Layer w0.254: R3.1 33.11,14.21 Q3.1 33.04,14.28 31.7,14.28
$1N46301: length 47.3
  Top Layer w0.254: U13.10 45.68,16.19 46.57,15.3 49.11,15.3 50,14.41 50,13.4 R28.1 51.01,12.38 51.01,10.98 49.42,9.38 36.99,9.38 36.66,9.71 36.66,14.15 36.92,14.41 38.69,14.41 42.12,10.98 46.82,10.98 47.33,11.49 47.33,12.16 46.86,12.63 44.66,12.63 44.28,13.01 44.28,13.54 U13.15
$1N57962: length 9.2
  Top Layer w0.254: 33.78,22.29 33.78,24.38 R32.1 33.79,26.16 ; 33.78,22.29 33.72,22.35 v1(33.02,22.35) ; 33.78,22.29 C19.2 ; U14.1 34.04,25.91 33.79,26.16 ; 33.79,26.16 R41.2
  Bottom Layer w0.254: v1(33.02,22.35) 32.26,23.11 32.26,24.53 U24.2
$1N57963: length 7.7
  Top Layer w0.254: C20.2 32.83,23.24 32.89,23.24 ; 32.89,23.24 32.12,24.01 R31.1 32.13,24.39 R40.2 31.87,25.91 U15.1 ; 32.89,23.24 v1(33.02,23.24)
  Bottom Layer w0.254: v1(33.02,23.24) 33.5,23.72 U24.3
$1N67734: length 3.6
  Top Layer w0.254: 71.83,27.23 75.23,27.23 U8.1
$1N67735: length 3.6
  Top Layer w0.254: 71.83,25.58 75.23,25.58 U5.1
$1N70426: length 6.6
  Bottom Layer w0.254: R13.1 81.16,10.41 83.69,10.41 84.5,9.61 ; R27.1 84.5,7.3 84.5,9.61 ; 84.5,9.61 84.59,9.52 Q1.1
$1N102233: length 10
  Top Layer w0.254: R30.1 52.19,27.1 C5.2 52.13,26.35 v1(52.45,26.03) 51.17,26.03 49.25,24.12 R43.2 48.82,24.2 47.5,24.2
  Bottom Layer w0.254: U25.2 52.5,25.48 52.45,25.53 v1(52.45,26.03)
$1N102234: length 8.1
  Top Layer w0.254: R29.1 53.86,27.1 C6.2 53.91,26.17 v1(53.68,25.94) 51.86,24.12 R42.2
  Bottom Layer w0.254: U25.3 53.68,24.95 v1(53.68,25.94)
$1N134604: length 3.6
  Top Layer w0.254: C1.2 77.36,12.76 75.4,12.76 74.81,13.34 U19.73
$1N134860: length 6.9
  Top Layer w0.254: v1(63.5,4.95) 63.5,4.97 U19.49 ; C12.2 v1(65.15,1.4)
  Bottom Layer w0.254: v1(65.15,1.4) 63.5,3.05 v1(63.5,4.95)
$1N137537: length 6.5
  Top Layer w0.254: X1.1 57.98,24.76 C14.2 60.03,22.46 60.06,22.43 60.16,22.32 60.16,21.66 U19.12
$1N137538: length 6.6
  Top Layer w0.254: 55.63,23.21 55.63,22.43 C15.2 56.9,21.37 R6.1 59.75,21.37 U19.13
$1N138361: length 30.1
  Top Layer w0.254: v1(71.12,16.13) 64.28,16.13 U19.14 ; C10.1 71.13,2.79 RST.1 v1(70.98,4.34) 70.68,4.64 R1.1
  Bottom Layer w0.254: v1(70.98,4.34) 71.39,4.34 72.52,5.46 72.52,14.73 v1(71.12,16.13)
$1N140381: length 11.9
  Top Layer w0.254: R44.1 NC.1 77.57,22.79 74.38,22.79 73.74,23.43 69.94,23.43 U19.94
$1N140807: length 28.4
  Top Layer w0.254: NC#2.1 R45.1 75.4,19.22 75.4,18.22 76.41,17.2 76.41,16.57 74.96,15.11 64.77,15.11 64.39,15.49 61.34,15.49 60.71,14.86 60.71,13.21 61.34,12.57 61.34,11.3 60.25,10.21 U19.37
$1N148453: length 3.4
  Top Layer w0.254: v1(57.62,19.74) 57.84,19.74 U19.18
  Bottom Layer w0.254: C16.1 56.16,19.74 v1(57.62,19.74)
$1N180282: length 2.1
  Bottom Layer w0.254: U1.2 56.05,3.5 R11.1

## Copper pours and planes (outline as drawn; the poured copper is in the pictures)
+5V on Top Layer: 16.47,11.05 20.79,11.05 20.79,4.88 16.47,4.88
+5V on Top Layer: 12.32,22.99 13.97,21.34 14.48,21.34 14.48,11.56 14.57,11.47 10.5,11.47 10.26,11.72 10.26,22.89 10.16,22.99
+5V on Top Layer: 11.39,13.9 19.14,13.9 19.14,10.85 11.39,10.85
+5V on Bottom Layer: 43.9,16.06 49.62,16.06 49.62,12.88 43.9,12.88
+5VUSB on Top Layer: 27.9,8.2 32.88,8.2 32.88,3.17 32.85,3.14 29.58,3.14 27.9,4.82
+5VUSBIN on Top Layer: 46.1,7.11 46.1,2.41 33.15,2.41 33.13,7.11
+5VUSBIN on Bottom Layer: 41.53,6.51 35.69,6.45 35.69,3.68 41.28,3.68 41.53,3.94
AGND on Top Layer: 26.5,16.44 34.15,16.44 34.15,13.66 26.5,13.66
AGND on Top Layer: 20.66,19.49 34.59,19.49 34.59,8.44 20.66,8.44
AGND on Top Layer: 14.95,8.82 26.03,8.82 26.03,1.93 14.95,1.93
AGND on Top Layer: 11.39,10.34 16.34,10.34 16.34,4.76 11.39,4.76
AGND on Bottom Layer: 2.29,10.17 0.95,10.17 0.9,10.22 0.9,6.36 1.02,6.1 2.29,6.1 2.41,6.22 2.41,9.89 2.29,10.02
AGND on Bottom Layer: 83.69,10.16 81.69,10.16 81.51,9.98 81.51,7.01 81.79,6.73 83.56,6.73 83.68,6.61 83.68,10.15
AGND on Bottom Layer: 49.78,7.49 44.45,7.49 44.49,4.23 45.23,3.49 49.76,3.49 49.78,3.52
AGND on Bottom Layer: 17.17,8.19 17.17,8.18 17.17,0.78 17.07,0.68 0.81,0.68 0.76,0.64 0.76,10.09 0.84,10.16 2.22,10.16 2.29,10.09 2.29,9.02 2.92,8.25
AGND on Inner1: 15.37,10.03 83.57,10.03 83.57,0.64 15.37,0.64
GND on Top Layer: 0,30 86,30 86,0 0,0
GND on Top Layer: 38.57,17.46 42.38,17.46 42.38,15.04 38.57,15.04
GND on Bottom Layer: 86,30 0,30 0,0 86,0
GND on Inner1: 0.26,29.74 85.74,29.74 85.74,0.26 0.26,0.26
VBAT on Top Layer: 22.31,19.54 33.65,19.54 33.65,16.57 22.31,16.57
VBAT on Top Layer: 22.31,16.8 24.22,16.8 24.22,11.23 22.31,11.23
VBAT on Bottom Layer: 84.44,18.42 80.26,18.42 80.26,15.11 84.43,15.11 84.44,15.13
VBAT on Bottom Layer: 32.96,8.69 28.96,12.7 28.96,19.69 22.32,19.69 22.31,19.68 22.31,14.91 30.73,6.6 41.78,6.6 41.78,4.06 44.2,4.06 44.17,4.09 44.17,8.69
VBAT on Bottom Layer: 1.65,20.95 1.65,15.24 5.84,15.24 5.84,20.95
VCC on Top Layer: 12.06,25.02 26.67,25.02 26.67,21.08 12.06,21.08
VCC on Inner2: 0.26,29.74 85.74,29.74 85.74,0.26 0.26,0.26
IOCHA on Inner2: 20.99,5.67 58.17,5.67 58.17,0.52 20.99,0.52
IOSTB on Inner2: 20.5,9.02 60.32,9.02 60.32,2.16 20.5,2.16
$1N20376 on Top Layer: 19.31,16.82 20.91,16.82 20.91,11.49 19.31,11.49
$1N20376 on Top Layer: 15.07,18.98 20.52,18.98 20.52,14.66 15.07,14.66
$1N20470 on Top Layer: 23.84,13.39 31.33,13.39 31.33,11.11 23.84,11.11
$1N32308 on Bottom Layer: 34.88,19.64 47.71,19.64 47.71,10.6 34.88,10.6
$1N68715 on Bottom Layer: 5.84,14.86 1.58,14.86 1.56,14.84 1.56,11.21 1.52,11.18 5.84,11.18
$1N70428 on Bottom Layer: 84.44,14.96 84.34,14.86 80.26,14.86 80.26,10.92 80.39,10.8 83.78,10.8 84.35,11.37 84.35,14.74 84.44,14.83
$1N148453 on Bottom Layer: 52.56,22.13 56.84,22.13 56.84,18.79 52.56,18.79

Small or netless copper shapes (teardrops, artwork), in the pictures only: 215 on Top Layer, 93 on Bottom Layer, 4 on Inner1

## Text on the board
Bottom Silkscreen Layer: GTR5 | NPCG | VGCD | 123G | AGBT5V
Top Silkscreen Layer: D | C | 5V | GND
